# EAGLE design FLYTE-v2 (EAGLE 9.6.2)
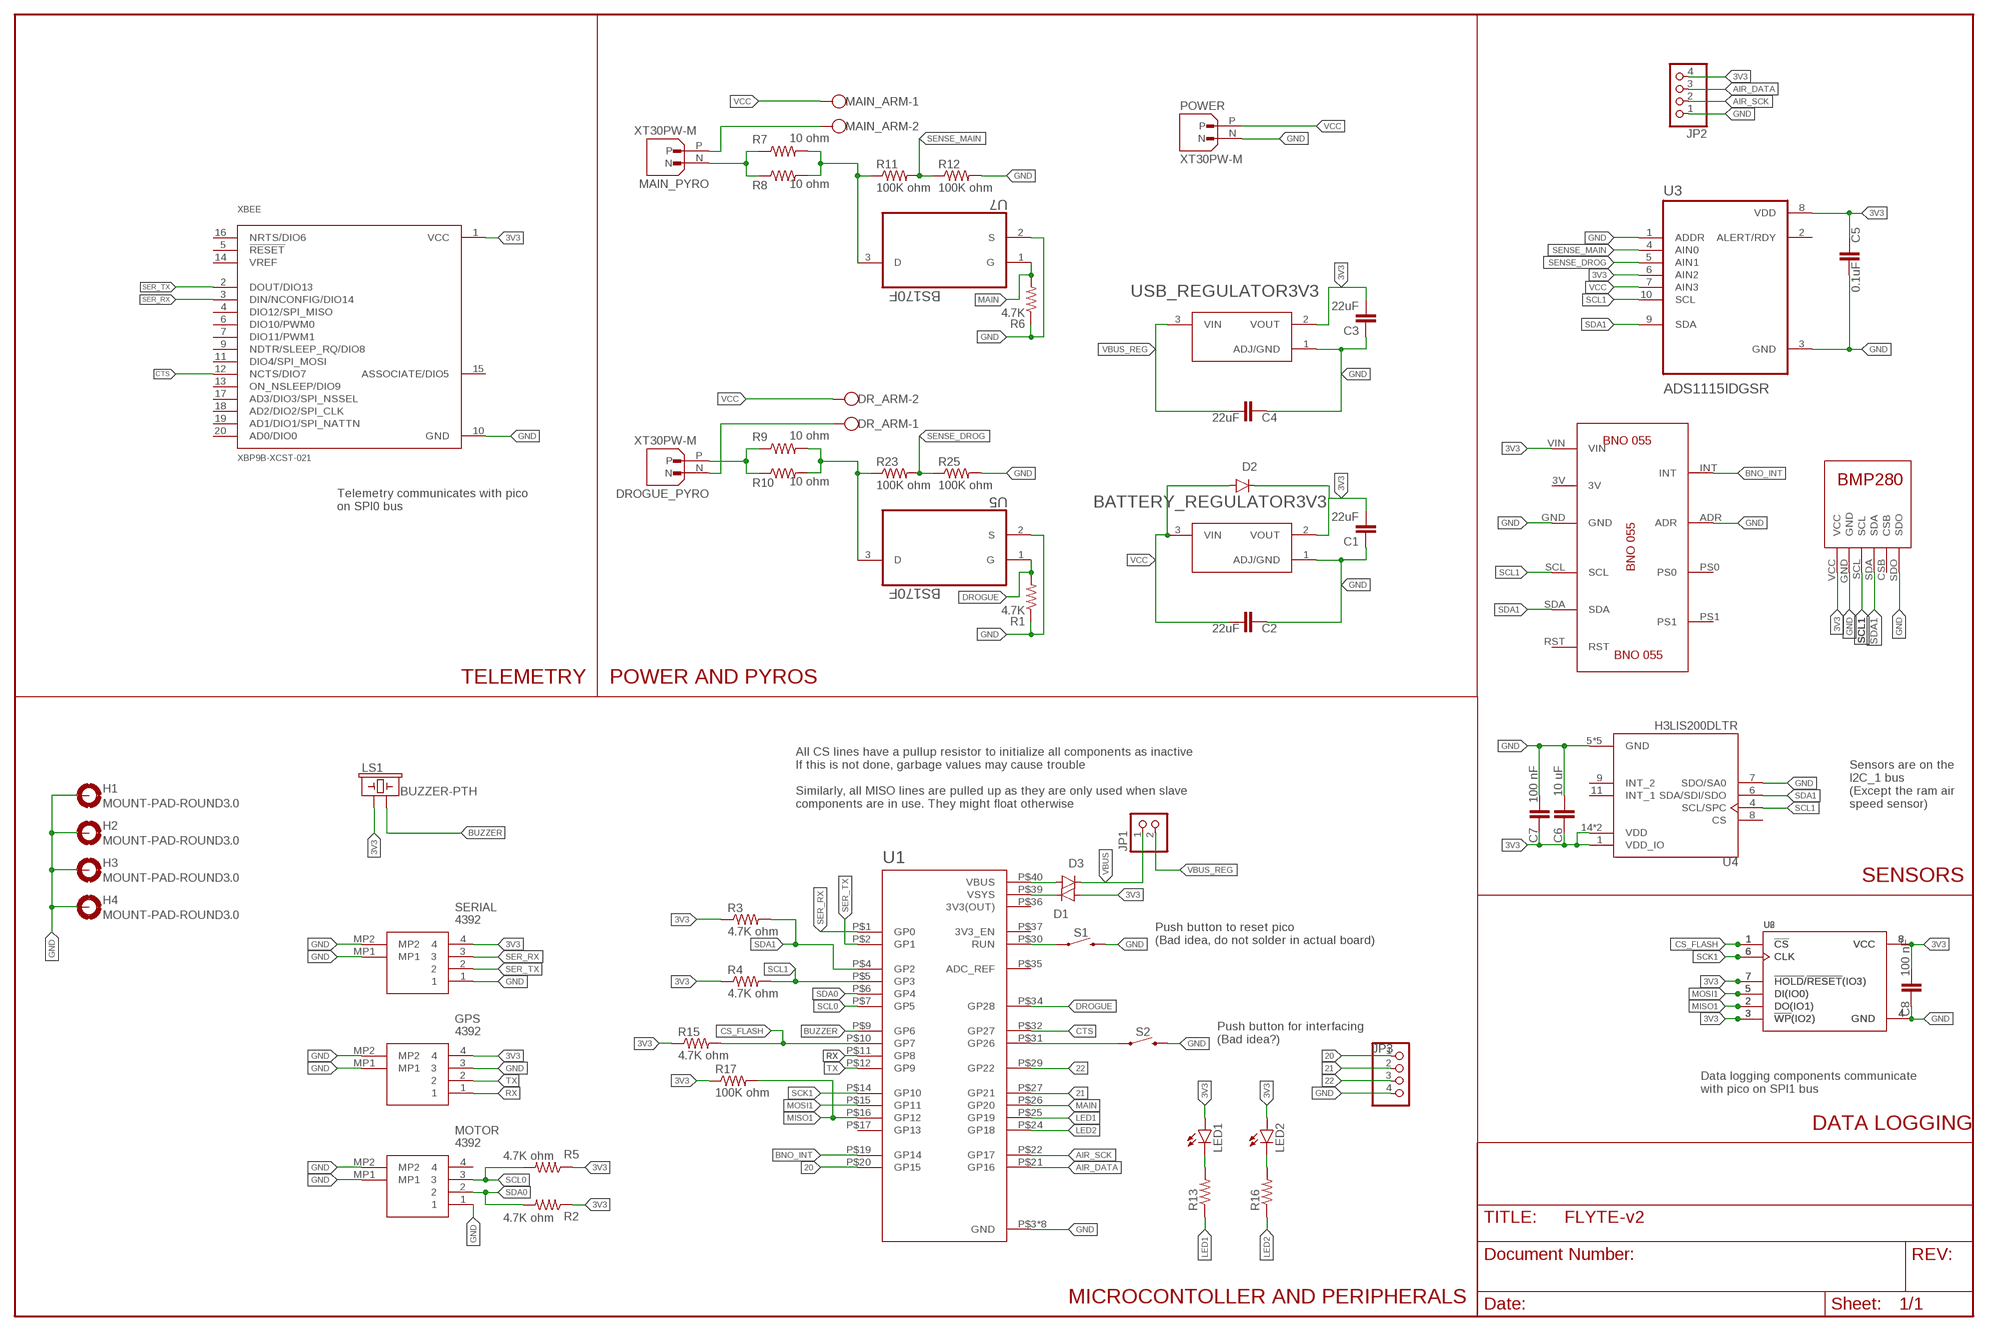
[diagram p0: schematic, sheet 1]

## Parts
BATTERY_REGULATOR3V3  AMS1117-3.3  [SOT229P700X180-4N]
C1  22uF  22UF-0805-6.3V-20%  [0805]
C2  22uF  22UF-0805-6.3V-20%  [0805]
C3  22uF  22UF-0805-6.3V-20%  [0805]
C4  22uF  22UF-0805-6.3V-20%  [0805]
C5  0.1uF  22UF-0805-6.3V-20%  [0805]
C6  10 uF  22UF-0805-6.3V-20%  [0805]
C7  100 nF  22UF-0805-6.3V-20%  [0805]
C8  100 nF  22UF-0805-6.3V-20%  [0805]
D1  1N4004  [DO41-10]
D2  1N4004  [DO41-10]
D3  1N4004  [DO41-10]
DR_ARM  W237-102  [W237-102]
DROGUE_PYRO  XT30PW-M  [AMASS_XT30PW-M]
GPS  4392  [4392]
H1  MOUNT-PAD-ROUND3.0  [3,0-PAD]
H2  MOUNT-PAD-ROUND3.0  [3,0-PAD]
H3  MOUNT-PAD-ROUND3.0  [3,0-PAD]
H4  MOUNT-PAD-ROUND3.0  [3,0-PAD]
JP1  PINHD-1X2  [1X02]
JP2  PINHD-1X4  [1X04]
JP3  PINHD-1X4  [1X04]
LED1  LEDCHIPLED_1206  [CHIPLED_1206]
LED2  LEDCHIPLED_1206  [CHIPLED_1206]
LS1  BUZZER-PTH  [BUZZER-12MM]
MAIN_ARM  W237-102  [W237-102]
MAIN_PYRO  XT30PW-M  [AMASS_XT30PW-M]
MOTOR  4392  [4392]
POWER  XT30PW-M  [AMASS_XT30PW-M]
R1  4.7K  R-US_R0805  [R0805]
R2  4.7K ohm  R-US_R0805  [R0805]
R3  4.7K ohm  R-US_R0805  [R0805]
R4  4.7K ohm  R-US_R0805  [R0805]
R5  4.7K ohm  R-US_R0805  [R0805]
R6  4.7K  R-US_R0805  [R0805]
R7  10 ohm  R-US_0207/10  [0207/10]
R8  10 ohm  R-US_0207/10  [0207/10]
R9  10 ohm  R-US_0207/10  [0207/10]
R10  10 ohm  R-US_0207/10  [0207/10]
R11  100K ohm  R-US_R0805  [R0805]
R12  100K ohm  R-US_R0805  [R0805]
R13  R-US_R0805  [R0805]
R15  4.7K ohm  R-US_R0805  [R0805]
R16  R-US_R0805  [R0805]
R17  100K ohm  R-US_R0805  [R0805]
R23  100K ohm  R-US_R0805  [R0805]
R25  100K ohm  R-US_R0805  [R0805]
S1  MOMENTARY-SWITCH-SPST-PTH-6.0MM  [TACTILE_SWITCH_PTH_6.0MM]
S2  MOMENTARY-SWITCH-SPST-PTH-6.0MM  [TACTILE_SWITCH_PTH_6.0MM]
SERIAL  4392  [4392]
U1  RASPBERRY_PICO-NO_DEBUG  [PICO-PKG-NO_DEBUG]
U2  W25Q32JVSSIQ  [SOIC127P790X216-8N]
U3  ADS1115IDGSR  [SOP50P490X110-10N]
U4  H3LIS200DLTR  [PQFN50P300X300X100-16N]
U5  BS170F  [SOT91P240X120-3N]
U6  W25Q32JVSSIQ  [SOIC127P790X216-8N]
U7  BS170F  [SOT91P240X120-3N]
U$1  BMP280  [BMP280]
U$4  BNO055  [BNO055]
USB_REGULATOR3V3  AMS1117-3.3  [SOT229P700X180-4N]
XBEE  XBP9B-XCST-021  [DIP2200W51P200L3294H279Q20P]

## Nets
3V3: BATTERY_REGULATOR3V3.2(VOUT) C1.2 C3.2 C5.1 C6.1 C7.1 C8.2 D1.A D2.C GPS.4 JP2.4 LED1.A LED2.A LS1.+ R2.1 R3.1 R4.1 R5.1 R15.1 R17.1 SERIAL.4 U2.3(!WP!(IO2)) U2.7(!HOLD!/!RESET!(IO3)) U2.8(VCC) U3.6(AIN2) U3.8(VDD) U4.1(VDD_IO) U4.14(VDD) U4.15(VDD) U6.3(!WP!(IO2)) U6.7(!HOLD!/!RESET!(IO3)) U6.8(VCC) U$1.VCC U$4.VIN USB_REGULATOR3V3.2(VOUT) XBEE.1(VCC)
20: JP3.1 U1.P$20(GP15)
21: JP3.2 U1.P$27(GP21)
22: JP3.3 U1.P$29(GP22)
AIR_DATA: JP2.3 U1.P$21(GP16)
AIR_SCK: JP2.2 U1.P$22(GP17)
BNO_INT: U1.P$19(GP14) U$4.INT
BUZZER: LS1.- U1.P$9(GP6)
CS_FLASH: R15.2 U1.P$10(GP7) U2.1(!CS) U6.1(!CS)
CTS: U1.P$32(GP27) XBEE.12(NCTS/DIO7)
DROGUE: R1.2 U1.P$34(GP28) U5.1(G)
GND: BATTERY_REGULATOR3V3.1(ADJ/GND) C1.1 C2.1 C3.1 C4.1 C5.2 C6.2 C7.2 C8.1 GPS.3 GPS.MP1 GPS.MP2 H1.B3,0(MOUNT) H2.B3,0(MOUNT) H3.B3,0(MOUNT) H4.B3,0(MOUNT) JP2.1 JP3.4 MOTOR.1 MOTOR.MP1 MOTOR.MP2 POWER.N R1.1 R6.1 R12.2 R25.2 S1.3 S2.3 SERIAL.1 SERIAL.MP1 SERIAL.MP2 U1.P$3(GND) U1.P$8(GND) U1.P$13(GND) U1.P$18(GND) U1.P$23(GND) U1.P$28(GND) U1.P$33(GND) U1.P$38(GND) U2.4(GND) U3.1(ADDR) U3.3(GND) U4.5(GND) U4.7(SDO/SA0) U4.10(GND) U4.12(GND) U4.13(GND) U4.16(GND) U5.2(S) U6.4(GND) U7.2(S) U$1.GND U$1.SDO U$4.ADR U$4.GND USB_REGULATOR3V3.1(ADJ/GND) XBEE.10(GND)
LED1: R13.1 U1.P$25(GP19)
LED2: R16.1 U1.P$24(GP18)
MAIN: R6.2 U1.P$26(GP20) U7.1(G)
MISO1: R17.2 U1.P$16(GP12) U2.2(DO(IO1)) U6.2(DO(IO1))
MOSI1: U1.P$15(GP11) U2.5(DI(IO0)) U6.5(DI(IO0))
N$1: D1.C U1.P$39(VSYS)
N$2: DR_ARM.1 DROGUE_PYRO.N
N$3: S2.1 U1.P$31(GP26)
N$4: MAIN_PYRO.N R7.1 R8.1
N$5: R7.2 R8.2 R11.1 U7.3(D)
N$6: MAIN_ARM.2 MAIN_PYRO.P
N$7: DROGUE_PYRO.P R9.1 R10.1
N$8: S1.1 U1.P$30(RUN)
N$12: R9.2 R10.2 R23.1 U5.3(D)
N$14: LED1.C R13.2
N$15: LED2.C R16.2
N$17: D3.A U1.P$40(VBUS)
RX: GPS.1 U1.P$11(GP8)
SCK1: U1.P$14(GP10) U2.6(CLK) U6.6(CLK)
SCL0: MOTOR.3 R5.2 U1.P$7(GP5)
SCL1: R4.2 U1.P$5(GP3) U3.10(SCL) U4.4(SCL/SPC) U$1.SCL U$4.SCL
SDA0: MOTOR.2 R2.2 U1.P$6(GP4)
SDA1: R3.2 U1.P$4(GP2) U3.9(SDA) U4.6(SDA/SDI/SDO) U$1.SDA U$4.SDA
SENSE_DROG: R23.2 R25.1 U3.5(AIN1)
SENSE_MAIN: R11.2 R12.1 U3.4(AIN0)
SER_RX: SERIAL.3 U1.P$1(GP0) XBEE.3(DIN/NCONFIG/DIO14)
SER_TX: SERIAL.2 U1.P$2(GP1) XBEE.2(DOUT/DIO13)
TX: GPS.2 U1.P$12(GP9)
VBUS: D3.C JP1.1
VBUS_REG: C4.2 JP1.2 USB_REGULATOR3V3.3(VIN)
VCC: BATTERY_REGULATOR3V3.3(VIN) C2.2 D2.A DR_ARM.2 MAIN_ARM.1 POWER.P U3.7(AIN3)
Unconnected: MOTOR.4 U1.P$17(GP13) U1.P$35(ADC_REF) U1.P$37(3V3_EN) U3.2(ALERT/RDY) U4.8(CS) U4.9(INT_2) U4.11(INT_1) U$1.CSB U$4.3V U$4.PS0 U$4.PS1 U$4.RST XBEE.4(DIO12/SPI_MISO) XBEE.5(!RESET) XBEE.6(DIO10/PWM0) XBEE.7(DIO11/PWM1) XBEE.9(NDTR/SLEEP_RQ/DIO8) XBEE.11(DIO4/SPI_MOSI) XBEE.13(ON_NSLEEP/DIO9) XBEE.14(VREF) XBEE.15(ASSOCIATE/DIO5) XBEE.16(NRTS/DIO6) XBEE.17(AD3/DIO3/SPI_NSSEL) XBEE.18(AD2/DIO2/SPI_CLK) XBEE.19(AD1/DIO1/SPI_NATTN) XBEE.20(AD0/DIO0)

## Notes on the sheet
- Telemetry communicates with pico 
  on SPI0 bus
- TELEMETRY | POWER AND PYROS
- All CS lines have a pullup resistor to initialize all components as inactive
  If this is not done, garbage values may cause trouble
  
  Similarly, all MISO lines are pulled up as they are only used when slave
  components are in use. They might float otherwise
- Sensors are on the
  I2C_1 bus 
  (Except the ram air 
  speed sensor)
- SENSORS
- Push button to reset pico
  (Bad idea, do not solder in actual board)
- Push button for interfacing
  (Bad idea?)
- Data logging components communicate 
  with pico on SPI1 bus
- DATA LOGGING
- MICROCONTOLLER AND PERIPHERALS

## Power pins joined to a net without a drawn wire
3V3(OUT): U1.P$36(3V3(OUT))

## Library data of the parts
BATTERY_REGULATOR3V3 USB_REGULATOR3V3 = AMS1117-3.3:AMS1117-3.3: Sot223/Pkg 1-Amp 3.3-Volt Low Drop Out Voltage Regulatator Check availability <https://pricing.snapeda.com/parts/AMS1117-3.3/Advanced%20Monolithic%20Systems/view-part?ref=eda>; AVAILABILITY: Not in stock; DESCRIPTION: Sot223/Pkg 1-Amp 3.3-Volt Low Drop Out Voltage Regulatator; MF: Advanced Monolithic Systems; MP: AMS1117-3.3; PACKAGE: SOT-223 Seeed Technology; PRICE: None
C1-C4 = SparkFun-Capacitors:22UF: 22µF ceramic capacitors A capacitor is a passive two-terminal electrical component used to store electrical energy temporarily in an electric field.; PROD_ID: CAP-08402
C5-C8 = SparkFun-Capacitors:22UF: 22µF ceramic capacitors A capacitor is a passive two-terminal electrical component used to store electrical energy temporarily in an electric field.; PROD_ID: CAP-08402; VALUE: 22uF
D1-D3 = diode:1N4004: DIODE general purpose rectifier, 1 A
DR_ARM MAIN_ARM = con-wago-500:W237-102: WAGO SCREW CLAMP; MPN: 237-102; OC_FARNELL: unknown; OC_NEWARK: 70K9898
DROGUE_PYRO MAIN_PYRO POWER = XT30PW-M:XT30PW-M: Check availability <https://pricing.snapeda.com/parts/XT30PW-M/AMASS/view-part?ref=eda>; AVAILABILITY: Not in stock; CHECK_PRICES: https://www.snapeda.com/parts/XT30PW-M/AMASS/view-part/?ref=eda; DESCRIPTION: Socket; DC supply; XT30; male; PIN: 2; on PCBs; THT; Colour: yellow; MF: AMASS; MP: XT30PW-M; PACKAGE: None; PRICE: None; SNAPEDA_LINK: https://www.snapeda.com/parts/XT30PW-M/AMASS/view-part/?ref=snap
GPS MOTOR SERIAL = 4392:4392: Adafruit Accessories JST PH 4-pin Horizontal Connector (10-pack) - STEMMA Source: Datasheet <https://www.mouser.dk/datasheet/2/737/4389_C13924-001_CCP-W20-03-BK-SMT-R-A-1708610.pdf>; DESCRIPTION: Adafruit Accessories JST PH 4-pin Horizontal Connector (10-pack) - STEMMA; HEIGHT: 6.85mm; MANUFACTURER_NAME: Adafruit; MANUFACTURER_PART_NUMBER: 4392; MOUSER_PART_NUMBER: 485-4392; MOUSER_PRICE-STOCK: https://www.mouser.co.uk/ProductDetail/Adafruit/4392?qs=xZ%2FP%252Ba9zWqbG2TKb%252Bnxciw%3D%3D
H1-H4 = holes:MOUNT-PAD-ROUND: MOUNTING PAD, round
JP1 = pinhead:PINHD-1X2: PIN HEADER
JP2 JP3 = pinhead:PINHD-1X4: PIN HEADER
LED1 LED2 = led:LED: LED OSRAM: - CHIPLED LG R971, LG N971, LY N971, LG Q971, LY Q971, LO R971, LY R971 LH N974, LH R974 LS Q976, LO Q976, LY Q976 LO Q996 - Hyper CHIPLED LW Q18S LB Q993, LB Q99A, LB R99A - SideLED LS A670, LO A670, LY A670, LG A670, LP A670 LB A673, LV A673, LT A673, LW A673 LH A674 LY A675 LS A676, LA A676, LO A676, LY A676, LW A676 LS A679, LY A679, LG A679 - Hyper Micro SIDELED® LS Y876, LA Y876, LO Y876, LY Y876 LT Y87S - SmartLED LW L88C, LW L88S LB L89C, LB L89S, LG L890 LS L89K, LO L89K, LY L89K LS L896, LA L896, LO L896, LY L896 - TOPLED LS T670, LO T670, LY T670, LG T670, LP T670 LSG T670, LSP T670, LSY T670, LOP T670, LYG T670 LG T671, LOG T671, LSG T671 LB T673, LV T673, LT T673, LW T673 LH T674 LS T676, LA T676, LO T676, LY T676, LB T676, LH T676, LSB T676, LW T676 LB T67C, LV T67C, LT T67C, LS T67K, LO T67K, LY T67K, LW E67C LS E67B, LA E67B, LO E67B, LY E67B, LB E67C, LV E67C, LT E67C LW T67C LS T679, LY T679, LG T679 LS T770, LO T770, LY T770, LG T770, LP T770 LB T773, LV T773, LT T773, LW T773 LH T774 LS E675, LA E675, LY E675, LS T675 LS T776, LA T776, LO T776, LY T776, LB T776 LHGB T686 LT T68C, LB T68C - Hyper Mini TOPLED® LB M676 - Mini TOPLED Santana® LG M470 LS M47K, LO M47K, LY M47K Source: http://www.osram.convergy.de LUXEON: - LUMILED® LXK2-PW12-R00, LXK2-PW12-S00, LXK2-PW14-U00, LXK2-PW14-V00 LXK2-PM12-R00, LXK2-PM12-S00, LXK2-PM14-U00 LXK2-PE12-Q00, LXK2-PE12-R00, LXK2-PE12-S00, LXK2-PE14-T00, LXK2-PE14-U00 LXK2-PB12-K00, LXK2-PB12-L00, LXK2-PB12-M00, LXK2-PB14-N00, LXK2-PB14-P00, LXK2-PB14-Q00 LXK2-PR12-L00, LXK2-PR12-M00, LXK2-PR14-Q00, LXK2-PR14-R00 LXK2-PD12-Q00, LXK2-PD12-R00, LXK2-PD12-S00 LXK2-PH12-R00, LXK2-PH12-S00 LXK2-PL12-P00, LXK2-PL12-Q00, LXK2-PL12-R00 Source: www.luxeon.com KINGBRIGHT: KA-3528ASYC Source: www.kingbright.com
LS1 = SparkFun-Electromechanical:BUZZER: Buzzer Small round buzzers that operate around the audible 2kHz range. You can use these as speakers to create simple music or user interfaces. Variant Overview: PTH - Mini Speaker - PC Mount 12mm 2.048kHz <https://www.sparkfun.com/products/7950> PTH_KIT - Mini Speaker - PC Mount 12mm 2.048kHz <https://www.sparkfun.com/products/7950> KIT simplifies soldering by adding stop mask to one side of the pads. PTH_NO_SILK - Mini Speaker - PC Mount 12mm 2.048kHz <https://www.sparkfun.com/products/7950> No silkscreen indicator of buzzer outline. PTH_KIT_NO_SILK - Mini Speaker - PC Mount 12mm 2.048kHz <https://www.sparkfun.com/products/7950> KIT package w/o silkscreen SMD - Buzzer Audio Magnetic (CCV-084B16) SMD buzzer used on, e.g. the LilyPad Buzzer <https://www.sparkfun.com/products/8463> and RFID USB Reader <https://www.sparkfun.com/products/9963>. SMD_KIT - Buzzer Audio Magnetic (CCV-084B16) SMD Buzzer with elongated pins to make soldering easier. Used on the SparkFun Simon Says - Surface Mount Soldering Kit <https://www.sparkfun.com/products/10935>. SMD-SQUARE - Buzzer Audio Magnetic (COMP-15701) SMT square buzzer with one chamfered corner.; PROD_ID: COMP-08253; SF_SKU: COM-07950
R1-R13 R15-R17 R23 R25 = rcl:R-US_: RESISTOR, American symbol; SPICEPREFIX: R
S1 S2 = SparkFun-Switches:MOMENTARY-SWITCH-SPST: Momentary Switch (Pushbutton) - SPST Normally-open (NO) SPST momentary switches (buttons, pushbuttons). Variants PTH-12MM - 12mm square, through-hole Momentary Pushbutton Switch - 12mm Square <https://www.sparkfun.com/products/9190> (COM-09190) PTH-6.0MM, PTH-6.0MM-KIT - 6.0mm square, through-hole Mini Pushbutton Switch <https://www.sparkfun.com/products/97> (COM-00097) KIT package intended for soldering kit's - only one side of pads' copper is exposed. PTH-RIGHT-ANGLE-KIT - Right-angle, through-hole Right Angle Tactile Button <https://www.sparkfun.com/products/10791> - Used on SparkFun BigTime Watch Kit <https://www.sparkfun.com/products/11734> SMD-12MM - 12mm square, surface-mount Tactile Button - SMD (12mm) <https://www.sparkfun.com/products/12993> (COM-12993) Used on SparkFun PicoBoard <https://www.sparkfun.com/products/11888> SMD-4.5MM - 4.5mm Square Trackball Switch Used on SparkFun Blackberry Trackballer Breakout <https://www.sparkfun.com/products/13169> SMD-4.6MMX2.8MM - 4.60mm x 2.80mm, surface mount Used on SparkFun Pro Micro - RP2040 <https://www.sparkfun.com/products/17717> SMD-5.2MM, SMD-5.2-REDUNDANT - 5.2mm square, surface-mount Mini Pushbutton Switch - SMD <https://www.sparkfun.com/products/8720> (COM-08720) Used on Arduino Pro Mini <https://www.sparkfun.com/products/11114> REDUNDANT package connects both switch circuits together SMD-6.0X3.5MM - 6.0 x 3.5mm, surface mount Momentary Reset Switch SMD <https://www.sparkfun.com/products/8229> (COM-08229) SMD-6.2MM-TALL - 6.2mm square, surface mount Tactile Button - SMD (6mm) <https://www.sparkfun.com/products/12992> Used on SparkFun Digital Sandbox <https://www.sparkfun.com/products/12651> SMD-RIGHT-ANGLE - Right-angle, surface mount Used on SparkFun Block for Intel® Edison - Arduino <https://www.sparkfun.com/products/13036>; PROD_ID: SWCH-08441; SF_SKU: COM-00097
U1 = RpiPico:RASPBERRY_PICO-NO_DEBUG
U2 U6 = W25Q32JVSSIQ:W25Q32JVSSIQ: NOR Flash Serial-SPI 3V/3.3V 32M-bit 4M x 8 8.5ns 8-Pin SOIC Check availability <https://pricing.snapeda.com/parts/W25Q32JVSSIQ/Winbond/view-part?ref=eda>; AVAILABILITY: In Stock; DESCRIPTION: FLASH - NOR Memory IC 32Mb (4M x 8) SPI - Quad I/O 133 MHz 8-SOIC; MF: Winbond; MP: W25Q32JVSSIQ; PACKAGE: SOIC-8 Winbond; PRICE: None; PURCHASE-URL: https://pricing.snapeda.com/search/part/W25Q32JVSSIQ/?ref=eda
U3 = ADS1115IDGSR:ADS1115IDGSR: Check availability <https://pricing.snapeda.com/parts/ADS1115IDGSR/Texas%20Instruments/view-part?ref=eda>; AVAILABILITY: In Stock; CHECK_PRICES: https://www.snapeda.com/parts/ADS1115IDGSR/Texas+Instruments/view-part/?ref=eda; DESCRIPTION: 16-bit, 860-SPS, 4-channel, delta-sigma ADC with PGA, oscillator, VREF, comparator and I2C; MF: Texas Instruments; MP: ADS1115IDGSR; PACKAGE: VSSOP-10 Texas Instruments; PRICE: None; PURCHASE-URL: https://www.snapeda.com/api/url_track_click_mouser/?unipart_id=45903&manufacturer=Texas Instruments&part_name=ADS1115IDGSR&search_term=ads1115; SNAPEDA_LINK: https://www.snapeda.com/parts/ADS1115IDGSR/Texas+Instruments/view-part/?ref=snap
U4 = H3LIS200DLTR:H3LIS200DLTR: H3LIS200DL Series 3.6 V 400 Hz Low-Power 3-Axis Digital Accelerometer -TFLGA-16L Check availability <https://pricing.snapeda.com/parts/H3LIS200DLTR/STMicroelectronics/view-part?ref=eda>; AVAILABILITY: In Stock; CHECK_PRICES: https://www.snapeda.com/parts/H3LIS200DLTR/STMicroelectronics/view-part/?ref=eda; DESCRIPTION: Accelerometer X, Y, Z Axis ±100g, ±200g 25Hz ~ 500Hz 16-TFLGA (3x3); MF: STMicroelectronics; MP: H3LIS200DLTR; PACKAGE: TFLGA-16 STMicroelectronics; PRICE: None; PURCHASE-URL: https://www.snapeda.com/api/url_track_click_mouser/?unipart_id=523021&manufacturer=STMicroelectronics&part_name=H3LIS200DLTR&search_term=h3lis200dltr; SNAPEDA_LINK: https://www.snapeda.com/parts/H3LIS200DLTR/STMicroelectronics/view-part/?ref=snap
U5 U7 = BS170F:BS170F: DMOS FET Check availability <https://pricing.snapeda.com/parts/BS170F/Diodes%20Inc./view-part?ref=eda>; AVAILABILITY: In Stock; CHECK_PRICES: https://www.snapeda.com/parts/BS170F/Diodes+Inc./view-part/?ref=eda; DESCRIPTION: N-Channel 60 V 150µA (Ta) 330mW (Ta) Surface Mount SOT-23-3; MF: Diodes Inc.; MP: BS170F; PACKAGE: SOT-23 Multicomp; PRICE: None; SNAPEDA_LINK: https://www.snapeda.com/parts/BS170F/Diodes+Inc./view-part/?ref=snap
U$1 = BMP280:BMP280
U$4 = BNO055:BNO055
XBEE = XBP9B-XCST-021:XBP9B-XCST-021: XBee-PRO 900HP DigiMesh 900 MHz 200 Kbps RF Module with U.FL Connector Check availability <https://pricing.snapeda.com/parts/XBP9B-XCST-021/Digi%20International/view-part?ref=eda>; AVAILABILITY: In Stock; CHECK_PRICES: https://www.snapeda.com/parts/XBP9B-XCST-021/Digi+International/view-part/?ref=eda; DESCRIPTION: General ISM < 1GHz - Transceiver Module 920MHz Antenna Not Included, RP-SMA Through Hole; MF: Digi International; MP: XBP9B-XCST-021; PACKAGE: Module Digi International; PRICE: None; PURCHASE-URL: https://www.snapeda.com/api/url_track_click_mouser/?unipart_id=521579&manufacturer=Digi International&part_name=XBP9B-XCST-021&search_term=None; SNAPEDA_LINK: https://www.snapeda.com/parts/XBP9B-XCST-021/Digi+International/view-part/?ref=snap

## Board
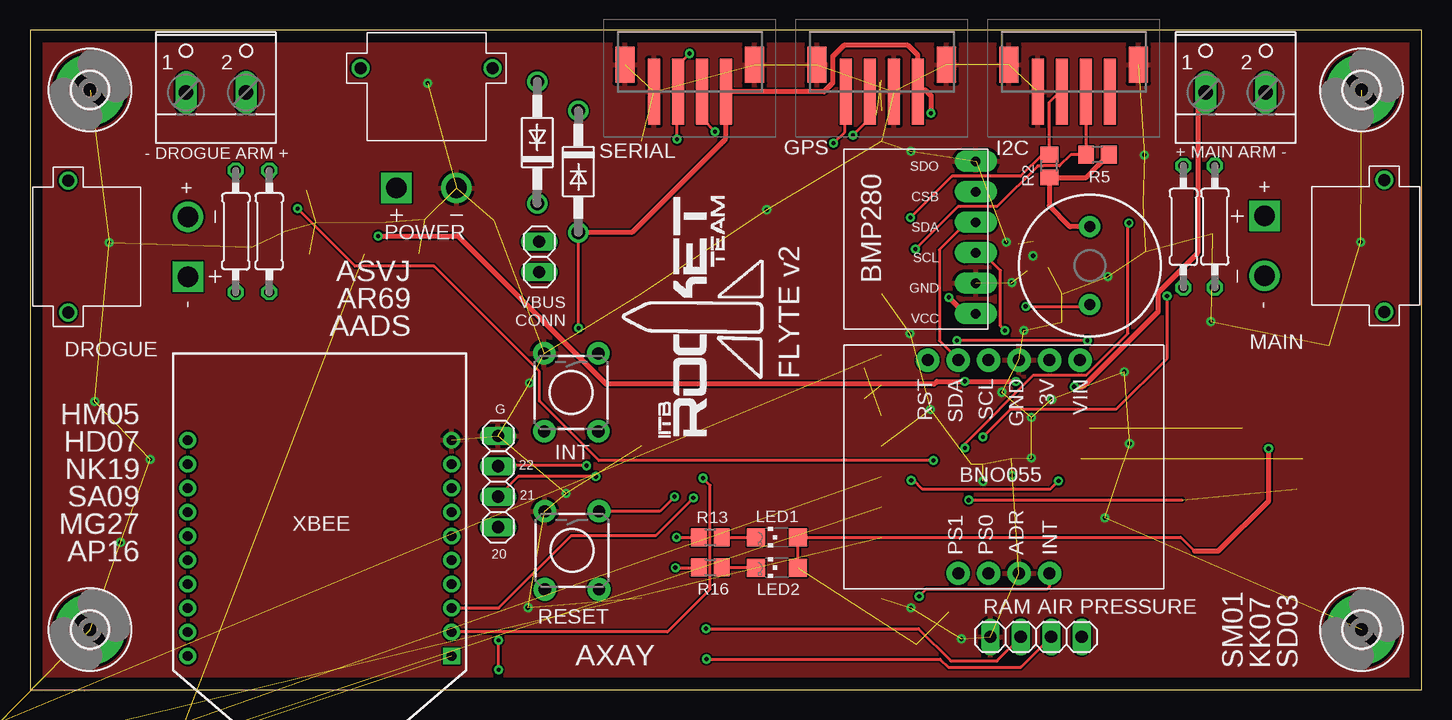
[diagram p1: board, top side]
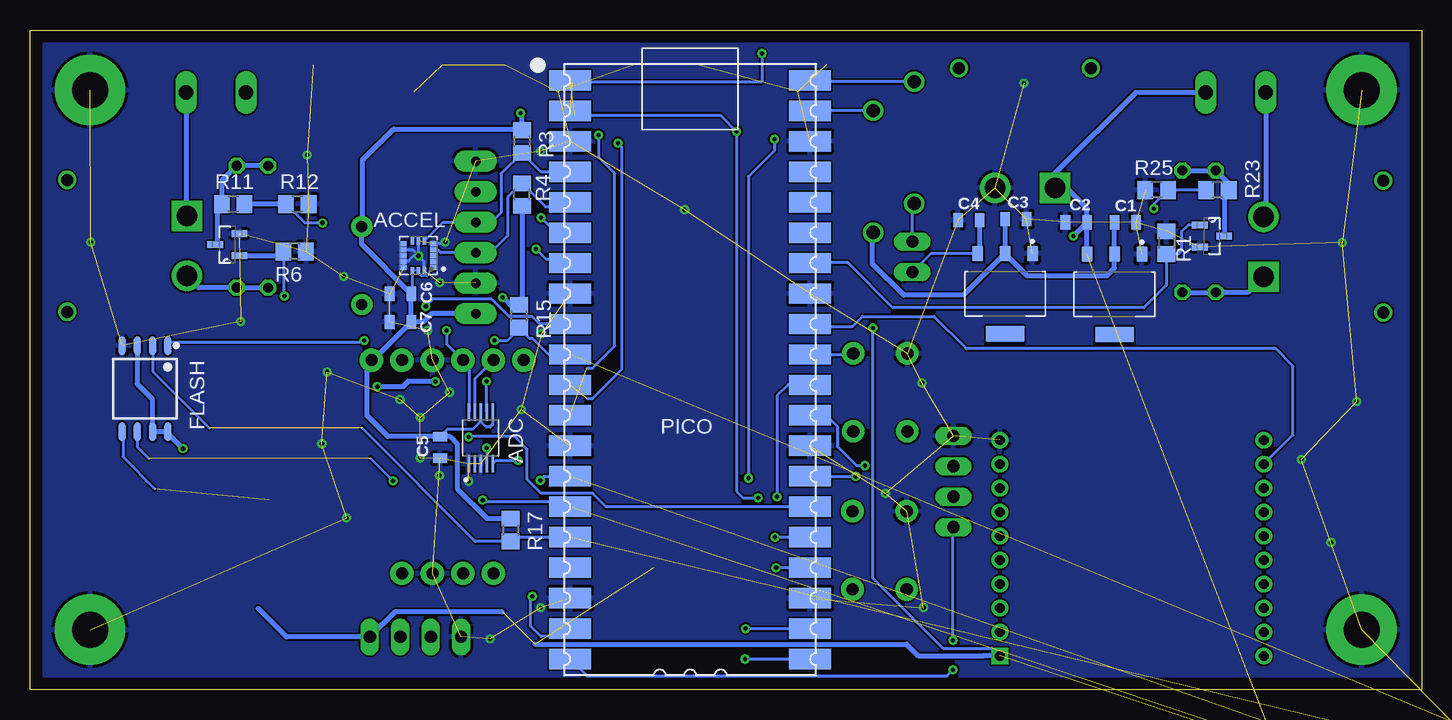
[diagram p2: board, bottom side, seen from below]

Size 116 x 55 mm. Coordinates in mm from the lower left corner, seen from the top.
Outline: 0,0 116,0 116,55 0,55 0,0
Copper layers (1*16): Top 0.035mm / dielectric 1.5mm / Bottom 0.035mm
Design rules "default": minimum track width 6mil, minimum drill 0.35mm, track to track 6mil, track to pad 6mil, pad to pad 6mil, via to via 6mil, smd to smd 6mil, copper to edge 40mil, drill to drill 6mil, minimum pad ring 10mil, minimum via ring 8mil, stop-mask expansion 4mil, vias tented up to drill 0mil, thermal gap 10mil

### Footprints (pad centres in the part's own frame; a part is rotated, then mirrored left to right if it is on the bottom)
SOT229P700X180-4N = smd 0.93 x 1.31: 1 -2.29,-3.345; 2 0,-3.345; 3 2.29,-3.345 | smd 3.24 x 1.31: 4 0,3.345
0805 = smd 0.8 x 1.2: 1 -0.9,0; 2 0.9,0
DO41-10 = drill 1.118: A 5.08,0; C -5.08,0
W237-102 = drill 1.194 long: 1 -2.5,-1.27; 2 2.5,-1.27
AMASS_XT30PW-M = drill 1.7: N 2.5,-10 | drill 1.7 square: P -2.5,-10 | drill 1: S1 5.5,0; S2 -5.5,0
4392 = smd 1 x 5.5: 1 3,3.5; 2 1,3.5; 3 -1,3.5; 4 -3,3.5 | smd 1.6 x 3: MP1 5.4,1.25; MP2 -5.4,1.25
3,0-PAD = drill 3 pad 5.842: B3,0 0,0
1X02 = drill 1.016 long: 1 -1.27,0; 2 1.27,0
1X04 = drill 1.016 long: 1 -3.81,0; 2 -1.27,0; 3 1.27,0; 4 3.81,0
CHIPLED_1206 = smd 1.5 x 1.5: A 0,-1.75; C 0,1.75
BUZZER-12MM = drill 0.9 pad 1.778: + 3.25,0; - -3.25,0
R0805 = smd 1.3 x 1.5: 1 -0.95,0; 2 0.95,0
0207/10 = drill 0.813 octagon: 1 -5.08,0; 2 5.08,0
TACTILE_SWITCH_PTH_6.0MM = drill 1.016 pad 1.88: 1 -3.251,2.261; 2 3.251,2.261; 3 -3.251,-2.261; 4 3.251,-2.261
PICO-PKG-NO_DEBUG = smd 3.5 x 1.7: P$1 -8.73,25.4; P$2 -8.73,22.86; P$3 -8.73,20.32; P$4 -8.73,17.78; P$5 -8.73,15.24; P$6 -8.73,12.7; P$7 -8.73,10.16; P$8 -8.73,7.62; P$9 -8.73,5.08; P$10 -8.73,2.54; P$11 -8.73,0; P$12 -8.73,-2.54; P$13 -8.73,-5.08; P$14 -8.73,-7.62; P$15 -8.73,-10.16; P$16 -8.73,-12.7; P$17 -8.73,-15.24; P$18 -8.73,-17.78; P$19 -8.73,-20.32; P$20 -8.73,-22.86; P$21 11.27,-22.86; P$22 11.27,-20.32; P$23 11.27,-17.78; P$24 11.27,-15.24; P$25 11.27,-12.7; P$26 11.27,-10.16; P$27 11.27,-7.62; P$28 11.27,-5.08; P$29 11.27,-2.54; P$30 11.27,0; P$31 11.27,2.54; P$32 11.27,5.08; P$33 11.27,7.62; P$34 11.27,10.16; P$35 11.27,12.7; P$36 11.27,15.24; P$37 11.27,17.78; P$38 11.27,20.32; P$39 11.27,22.86; P$40 11.27,25.4
SOIC127P790X216-8N = smd 1.6 x 0.6: 1 -3.6,1.905; 2 -3.6,0.635; 3 -3.6,-0.635; 4 -3.6,-1.905; 5 3.6,-1.905; 6 3.6,-0.635; 7 3.6,0.635; 8 3.6,1.905
SOP50P490X110-10N = smd 1.47 x 0.28: 1 -2.15,1; 2 -2.15,0.5; 3 -2.15,0; 4 -2.15,-0.5; 5 -2.15,-1; 6 2.15,-1; 7 2.15,-0.5; 8 2.15,0; 9 2.15,0.5; 10 2.15,1
PQFN50P300X300X100-16N = smd 0.53 x 0.35: 1 -1.22,1; 2 -1.22,0.5; 3 -1.22,0; 4 -1.22,-0.5; 5 -1.22,-1; 9 1.22,-1; 10 1.22,-0.5; 11 1.22,0; 12 1.22,0.5; 13 1.22,1 | smd 0.35 x 0.53: 6 -0.5,-1.22; 7 0,-1.22; 8 0.5,-1.22; 14 0.5,1.22; 15 0,1.22; 16 -0.5,1.22
SOT91P240X120-3N = smd 1.321 x 0.559: 1 -1.016,0.914; 2 -1.016,-0.914; 3 1.016,0
BMP280 = drill 0.8 pad 1.778 long: CSB 11.43,1; GND 3.81,1; SCL 6.35,1; SDA 8.89,1; SDO 13.97,1; VCC 1.27,1
BNO055 = drill 1 pad 1.93: 3V 9.525,1.27; ADR 12.065,19.05; GND 12.065,1.27; INT 9.525,19.05; PS0 14.605,19.05; PS1 17.145,19.05; RST 19.685,1.27; SCL 14.605,1.27; SDA 17.145,1.27; VIN 6.985,1.27
DIP2200W51P200L3294H279Q20P = drill 0.8 pad 1.4 square: 1 -11,8.75 | drill 0.8 pad 1.4: 2 -11,6.75; 3 -11,4.75; 4 -11,2.75; 5 -11,0.75; 6 -11,-1.25; 7 -11,-3.25; 8 -11,-5.25; 9 -11,-7.25; 10 -11,-9.25; 11 11,-9.25; 12 11,-7.25; 13 11,-5.25; 14 11,-3.25; 15 11,-1.25; 16 11,0.75; 17 11,2.75; 18 11,4.75; 19 11,6.75; 20 11,8.75

### Placement (x,y rotation side)
BATTERY_REGULATOR3V3  25.6,32.95 180 bottom
C1  24.7,38.95 180 bottom
C2  28.79,38.97 0 bottom
C3  33.82,39.23 180 bottom
C4  37.74,39.15 0 bottom
C5  81.81,20.19 270 bottom
C6  85.12,33 180 bottom
C7  85.12,30.65 180 bottom
C8  -8.12,-13.83 0 top  (outside the outline)
D1  45.71,43.19 270 top
D2  5.52,-8.72 0 top  (outside the outline)
D3  42.29,45.61 90 top
DR_ARM  15.5,51.06 0 top
DROGUE_PYRO  3.17,36.93 90 top
GPS  71,53.35 180 top
H1  5,5 0 top
H2  5,50 0 top
H3  111,5 0 top
H4  111,50 0 top
JP1  42.45,36.08 270 top
JP2  83.86,4.39 0 top
JP3  39.03,17.35 90 top
LED1  62.28,12.7 90 top
LED2  62.28,10.16 90 top
LS1  88.35,35.35 90 top
MAIN_ARM  100.5,51.06 0 top
MAIN_PYRO  112.91,37 270 top
MOTOR  87,53.35 180 top
POWER  33.05,51.83 0 top
R1  21.25,37.27 270 bottom
R2  84.96,43.65 90 top
R3  75,45.69 270 bottom
R4  75,41.27 90 bottom
R5  88.99,44.6 180 top
R6  93.94,36.54 180 bottom
R7  98.77,38.6 90 top
R8  96.15,38.59 90 top
R9  19.95,38.2 90 top
R10  17.15,38.2 90 top
R11  99.06,40.5 0 bottom
R12  93.72,40.5 0 bottom
R13  56.72,12.7 0 top
R15  75.24,31.14 270 bottom
R16  56.72,10.19 0 top
R17  75.93,13.3 270 bottom
R23  17.01,41.66 180 bottom
R25  22.08,41.66 180 bottom
S1  45.18,11.61 270 top
S2  45.12,24.78 270 top
SERIAL  55,53.35 180 top
U1  62.23,25.4 0 bottom
U2  -5.22,-7.2 0 top  (outside the outline)
U3  78.42,20.98 90 bottom
U4  83.63,36.17 180 bottom
U5  17.47,37.81 0 bottom
U6  106.43,25.08 270 bottom
U7  99.56,37.1 180 bottom
U$1  79.85,30.08 90 top
U$4  94.52,28.73 180 top
USB_REGULATOR3V3  34.72,33 180 bottom
XBEE  24.15,11.55 180 top

### Tracks (layer width: path | path; a pad name or v marks a point on that pad's centre or on a via)
3V3  (via drill 0.35)  (7 unrouted)
  Top 0.254: LED2.A LED1.A 95.93,12.7 97.1,11.53 | v45.72,30.15 D1.A
  Top 0.406: D1.A 50.17,38.11 57.97,45.91 57.97,49.97 SERIAL.4 66.19,49.85 66.92,50.57 66.92,52.78 67.85,53.72 73.18,53.72 74,52.9 GPS.4 74.15,50 74.64,50 75.11,49.53 v75.11,48.06 | LS1.+ 86.7,38.6 84.96,40.34 R2.1 88.04,42.7 89.04,43.7 R5.1 | v103.25,20.09 103.25,15.75 99.03,11.53 97.1,11.53 | v76.59,32.7 77.95,31.35 U$1.VCC
  Bottom 0.152: U4.14 U4.15 83.53,34.86 83.53,34.6 83.39,34.46 82.87,34.46 82.72,34.6 82.72,34.86 U4.1
  Bottom 0.254: U3.6 77.42,22.09 77.62,21.89 77.97,21.89 78.44,22.36 | 78.44,22.36 79.08,21.73 81.17,21.73 C5.1 | U3.8 78.42,22.38 78.44,22.36 | v45.72,30.15 45.72,9.28 39.88,3.44 35.8,3.44 XBEE.1 | U4.14 84.13,33.09 C6.1
  Bottom 0.406: C1.2 BATTERY_REGULATOR3V3.2 25.6,35.16 26.24,34.52 32.89,34.52 USB_REGULATOR3V3.2 | C7.1 87.41,27.46 U$4.VIN 87.91,27.09 87.91,22.84 86.16,21.09 C5.1 80.98,21.09 80.39,20.5 80.39,16.74 77.91,14.25 R17.1 | C7.1 C6.1 88.35,37.13 LS1.+ 88.3,38.65 88.3,44.13 85.69,46.75 75.1,46.75 R3.1 75,47.95 v75.11,48.06 | U6.3 107.08,28.66 107.08,25.5 105.79,24.21 U6.7 U6.8 104.52,21.36 v103.25,20.09 | C3.2 USB_REGULATOR3V3.2 | R4.1 75,32.33 R15.1 75.98,32.09 v76.59,32.7 | U$1.VCC 82.53,31.35 83.23,30.65 C7.1 | USB_REGULATOR3V3.2 38.17,32.89 43.16,32.89 45.8,35.53 45.8,38.02 | 45.8,38.02 45.95,38.02 45.86,38.11 D1.A 45.8,38.02 | 96.98,6.75 94.61,4.39 JP2.4 85.58,6.48 76.61,6.48 | XBEE.1 36.44,2.82 41.96,2.82 42.93,3.79 73.92,3.79
20  (via drill 0.35)
  Top 0.254: v39.05,1.64 v39.05,4.1
  Bottom 0.254: U1.P$20 69.56,1.14 39.55,1.14 v39.05,1.64 | v39.05,4.1 39.05,13.51 JP3.1
21  (via drill 0.35)
  Top 0.254: v47.17,17.75 40.7,17.75 JP3.2
  Bottom 0.254: U1.P$27 47.19,17.78 v47.17,17.75
22  (via drill 0.35)
  Top 0.254: v46.41,18.67 39.08,18.67 JP3.3
  Bottom 0.254: U1.P$29 49.61,22.86 48.69,21.95 48.69,20.27 47.09,18.67 v46.41,18.67
AIR_DATA  (via drill 0.35)
  Top 0.254: v56.39,2.54 75.87,2.54 76.56,1.85 82.6,1.85 JP2.3
  Bottom 0.254: U1.P$21 v56.39,2.54
AIR_SCK  (via drill 0.35)
  Top 0.254: v56.36,5.08 74.07,5.08 76.76,2.39 80.62,2.39 82.59,4.36 JP2.2
  Bottom 0.254: U1.P$22 v56.36,5.08
BNO_INT  (via drill 0.35)
  Top 0.254: v74.12,7.78 74.7,8.36 84.78,8.36 85,8.57 U$4.INT
  Bottom 0.254: v74.12,7.78 74.25,7.65 74.25,5.27 73.41,4.42 71.62,4.42 U1.P$19
BUZZER  (via drill 0.35)
  Top 0.254: v83.01,31.95 88.2,31.95 LS1.-
  Bottom 0.254: U1.P$9 73.51,30.48 74.15,31.12 76.08,31.12 77.55,32.59 82.37,32.59 v83.01,31.95
CS_FLASH  (via drill 0.35)  (1 unrouted)
  Top 0.254: v88.14,29.11 v77.27,29.11
  Bottom 0.254: 75.19,30.1 74.35,29.26 74.09,29.26 72.77,27.94 U1.P$10 | R15.2 75.17,30.12 75.19,30.1 | U6.1 104.52,28.87 104.41,28.98 88.21,28.98 88.14,29.06 v88.14,29.11 | v77.27,29.11 76.18,29.11 75.19,30.1
CTS
  Bottom 0.254: U1.P$32 50.76,30.28 47.45,30.28 46.61,31.11 40.64,31.11 37.95,28.42 12.17,28.42 10.72,26.98 10.72,21.23 XBEE.12
DROGUE
  Bottom 0.254: U5.1 19.45,38.73 20.01,38.17 20.01,36.59 20.29,36.32 R1.2 21.25,33.73 23.13,31.85 44.09,31.85 47.83,35.59 50.94,35.59 U1.P$34
GND  (via drill 0.35)  (81 unrouted)
  Bottom 0.254: U4.7 v83.63,36.18 v83.62,36.17 | U4.10 84.12,36.67 v83.62,36.17 | v83.62,36.17 84.03,36.17 84.47,35.72 84.8,35.72 U4.12 U4.13 | U4.16 83.13,35.68 v83.62,36.17 | v81.38,37.31 81.52,37.17 U4.5
  other vias: 83.49,19.33 83.49,22.7 81.88,17.86 79.45,17.38 73.43,6.81 89.86,34.45 5.41,24.03 81.03,24.79 85.17,24.18 82.85,29.95 77.65,4.22 73.43,44.88 81.84,33.93 75.06,23.37 73.36,29.69 10.01,19.18 7.54,12.26 98.45,30.68 91.24,26.49 91.67,20.5 89.61,14.3 41.63,25.58 44.68,16.36 41.5,6.83 92.89,44.58 61.42,40.01 6.6,37.26 110.92,37.31 33.15,50.57
  pour Bottom: -0.11,54.95 -0.11,-0.06 116.01,-0.06 116.01,54.95
  pour Top: 0.01,54.98 0.01,-0.09 116.07,-0.09 116.07,54.98
LED1  (via drill 0.35)
  Top 0.254: v53.9,12.7 R13.1
  Bottom 0.254: U1.P$25 v53.9,12.7
LED2  (via drill 0.35)
  Top 0.254: v53.8,10.16 55.74,10.16 R16.1
  Bottom 0.254: U1.P$24 v53.8,10.16
MAIN  (via drill 0.35)
  Top 0.254: v79.44,21.07 81.72,23.36 90.54,23.36 94.79,27.61 v94.79,32.82
  Bottom 0.254: U1.P$26 67.97,15.24 69.09,16.37 73.38,16.37 74.55,17.54 74.55,20.04 75.62,21.11 79.39,21.11 v79.44,21.07 | v94.79,32.82 94.79,36.44 R6.2
  Bottom 0.406: R6.2 95.25,36.18 U7.1
MISO1  (2 unrouted)
  Bottom 0.254: U6.2 105.76,28.65 105.76,26.52 101.05,21.81 | U1.P$16 75.58,12.7 R17.2 78.88,12.35 88.33,21.81
MOSI1  (via drill 0.35)  (2 unrouted)
  Top 0.254: v78.26,15.8 96.05,15.8
  Bottom 0.254: U6.5 108.25,21.4 108.25,19.4 105.58,16.73 | U1.P$15 71.37,15.65 78.26,15.65 v78.26,15.8
N$1
  Bottom 0.254: D1.C U1.P$39
N$2
  Bottom 0.406: DR_ARM.1 13,39.6 DROGUE_PYRO.N
N$3
  Bottom 0.254: U1.P$31 47.47,27.94 S2.1
N$4
  Bottom 0.406: R8.1 96.67,33.52 R7.1 101.93,33.52 MAIN_PYRO.N
N$5
  Bottom 0.406: U7.3 100.39,37.28 100.39,40.12 R11.1 100.01,42.44 R7.2 96.16,43.68 R8.2
N$6
  Bottom 0.406: MAIN_ARM.2 103,39.59 MAIN_PYRO.P
N$7
  Bottom 0.406: R9.1 R10.1 14.48,33.12 DROGUE_PYRO.P
N$8  (via drill 0.35)
  Top 0.254: v53.72,16.08 52.5,14.86 S1.1
  Bottom 0.254: U1.P$30 52.83,25.4 53.72,24.51 v53.72,16.08
N$12
  Bottom 0.406: R9.2 R10.2 16.06,42.2 R23.1 16.44,41.28 16.44,37.83 U5.3
N$14
  Top 0.254: R13.2 LED1.C
N$15
  Top 0.254: R16.2 60.51,10.19 LED2.C
N$17
  Bottom 0.254: D3.A 50.85,50.69 U1.P$40
RX  (via drill 0.35)  (1 unrouted)
  Top 0.254: v66.99,45.56 67.92,46.49 67.92,49.92 GPS.1
  Bottom 0.254: 69.55,24.27 69.09,24.27 66.67,26.69 66.67,45.25 v66.99,45.56
SCK1  (via drill 0.35)  (2 unrouted)
  Top 0.254: v85.74,17.41 85.03,16.69 74.42,16.69 73.64,17.48 73.48,17.48 v73.46,17.45
  Bottom 0.254: 106.09,19.27 107.06,20.24 U6.6 | 87.61,19.27 v85.74,17.41 | v73.46,17.45 73.13,17.78 U1.P$14
SCL0  (via drill 0.35)
  Top 0.254: MOTOR.3 88,44.63 R5.2 86.75,44.6 85.83,43.67 84.47,43.67 84.45,43.66 84.01,43.66 80.62,40.27 77.36,40.27 v73.81,36.73
  Bottom 0.254: v73.81,36.73 72.97,35.89 71.29,35.89 U1.P$7
SCL1  (via drill 0.35)
  Top 0.254: v81.28,29.95 80.91,30.32 80.91,34.95 79.42,36.43 U$1.SCL
  Bottom 0.254: U3.10 79.41,23.14 79.41,26.95 U$4.SCL 81.23,28.77 81.23,29.95 v81.28,29.95 | U1.P$5 70.79,40.64 70.41,40.26 73.04,40.26 R4.2 76.17,41.05 76.17,37.85 77.6,36.42 U$1.SCL 81.74,36.43 81.94,36.63 82.36,36.63 U4.4
SDA0  (via drill 0.35)
  Top 0.254: v73.41,39.34 76.86,42.8 82.57,42.8 84.38,44.6 R2.2 84.96,48.96 85.85,49.85 MOTOR.2
  Bottom 0.254: v73.41,39.34 72.16,38.1 U1.P$6
SDA1
  Top 0.254: U$1.SDA 78.09,38.97 75.8,36.68 75.8,29.1 77.38,27.53 U$4.SDA
  Bottom 0.254: U$4.SDA 78.92,25.91 U3.9 | U1.P$4 73.44,43.18 R3.2 76.73,43.01 76.73,39.75 77.52,38.97 U$1.SDA 81.55,38.97 U4.6
SENSE_DROG  (via drill 0.35)
  Top 0.254: v22.3,40.11 27.1,35.31 33.68,35.31 42.47,26.52 42.47,24.05 47.42,19.1 v75.31,19.1
  Bottom 0.254: v22.3,40.11 22.3,40.49 R25.1 R23.2 | U3.5 77.15,19.1 v75.31,19.1
SENSE_MAIN  (via drill 0.35)
  Top 0.254: v77.93,20.15 77.93,20.49 83.66,26.21 88.05,26.21 91.54,29.71 91.54,38.89 91.57,38.91 v91.62,38.91
  Bottom 0.254: U3.4 v77.93,20.15 | v77.93,20.15 | v91.62,38.91 93.08,38.91 R12.1
  Bottom 0.406: R12.1 R11.2
SER_RX  (via drill 0.35)  (1 unrouted)
  Top 0.254: v55.3,15.98 52.15,12.83 45.11,12.83 39.08,6.8 XBEE.3 | SERIAL.3 56,47.63 v57.1,46.53
  Bottom 0.254: 70.58,47.88 58.45,47.88 v57.1,46.53 57.1,16.53 56.54,15.98 v55.3,15.98
SER_TX  (via drill 0.35)  (1 unrouted)
  Top 0.254: v53.95,45.9 53.95,50.14 54,50.19 SERIAL.2 54,52.05 54.45,52.5 v54.99,53.04 | XBEE.2 53.13,4.8 56.7,8.36 56.7,17.04 v56.11,17.63
  Bottom 0.254: 70.81,50.65 55.09,50.65 54.99,50.75 v54.99,53.04 | v53.95,45.9 53.95,44.93 56.11,42.77 v56.11,17.63
TX  (via drill 0.35)  (1 unrouted)
  Top 0.254: v68.6,46.22 70.03,47.65 70.03,49.97 GPS.2
  Bottom 0.254: 69.55,26.81 69.09,26.81 67.25,28.65 67.25,43.04 68.61,44.4 v68.61,46.22 v68.6,46.22
VBUS
  Bottom 0.254: JP1.1 42.45,40.37 D3.C
VBUS_REG
  Bottom 0.254: USB_REGULATOR3V3.3 40.91,36.34 JP1.2
  Bottom 0.406: C4.2 36.84,36.52 USB_REGULATOR3V3.3
VCC  (via drill 0.35)  (1 unrouted)
  Top 0.406: v87.05,25.25 87.77,25.25 94.06,31.54 94.06,33.12 97.35,36.41 97.35,49.14 MAIN_ARM.1 | v82.2,25.7 82.19,25.7 v77.93,25.7 75.59,25.7 75.36,25.47 48.04,25.47 35.69,37.82 v29.03,37.82
  Bottom 0.254: U3.7 v77.92,25.7 v77.93,25.7
  Bottom 0.406: BATTERY_REGULATOR3V3.3 27.89,38.79 | 27.89,38.79 C2.2 27.89,40.16 29.56,41.83 POWER.P 30.55,43.07 23.83,49.79 DR_ARM.2 | v82.2,25.7 84.49,25.7 84.94,25.25 v87.05,25.25 | v29.03,37.82 28.07,38.79 27.89,38.79

### Text on the board
tPlace: AR69 | SA09 | MG27 | AP16 | SM01 | KK07 | SD03
tNames: SERIAL | GPS | I2C | - DROGUE ARM + | + MAIN ARM - | + | R2 | R5 | + | POWER | ASVJ | VBUS / CONN | - | - | AADS | MAIN | DROGUE | FLYTE v2 | HM05 | G | HD07 | NK19 | INT | 22 | 21 | R13 | 20 | R16 | RAM AIR PRESSURE | RESET | AXAY | C:/Users/shobh/OneDrive/Desktop/Rocket Team/FLYTE/Bitmaps/RT logo.bmp
bNames: ACCEL | FLASH | PICO | ADC